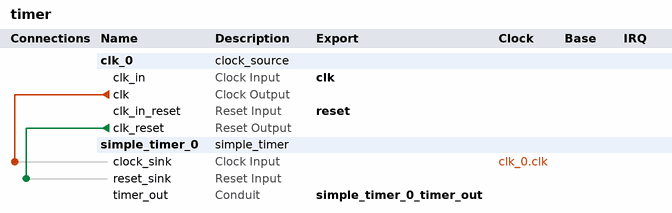
[diagram p0: system contents]
# Platform Designer (Qsys) system timer, Cyclone V 5CEBA4U19C8
# Parameters at their usual value, and those the tool derives, are not listed.
package require -exact qsys 16.1
create_system timer
set_project_property DEVICE_FAMILY {Cyclone V}
set_project_property DEVICE 5CEBA4U19C8

add_instance clk_0 clock_source 16.1
set_instance_parameter_value clk_0 clockFrequency 50000000

add_instance simple_timer_0 simple_timer 1.0
set_instance_parameter_value simple_timer_0 WIDTH 32

# connections
add_connection clk_0.clk simple_timer_0.clock_sink clock
add_connection clk_0.clk_reset simple_timer_0.reset_sink reset

# exported interfaces
add_interface clk clock sink
set_interface_property clk EXPORT_OF clk_0.clk_in
add_interface reset reset sink
set_interface_property reset EXPORT_OF clk_0.clk_in_reset
add_interface simple_timer_0_timer_out conduit end
set_interface_property simple_timer_0_timer_out EXPORT_OF simple_timer_0.timer_out

set_interconnect_requirement {$system} qsys_mm.clockCrossingAdapter HANDSHAKE
set_interconnect_requirement {$system} qsys_mm.maxAdditionalLatency 1

save_system timer.qsys
